# EAGLE design W706C (EAGLE 6.6.0)
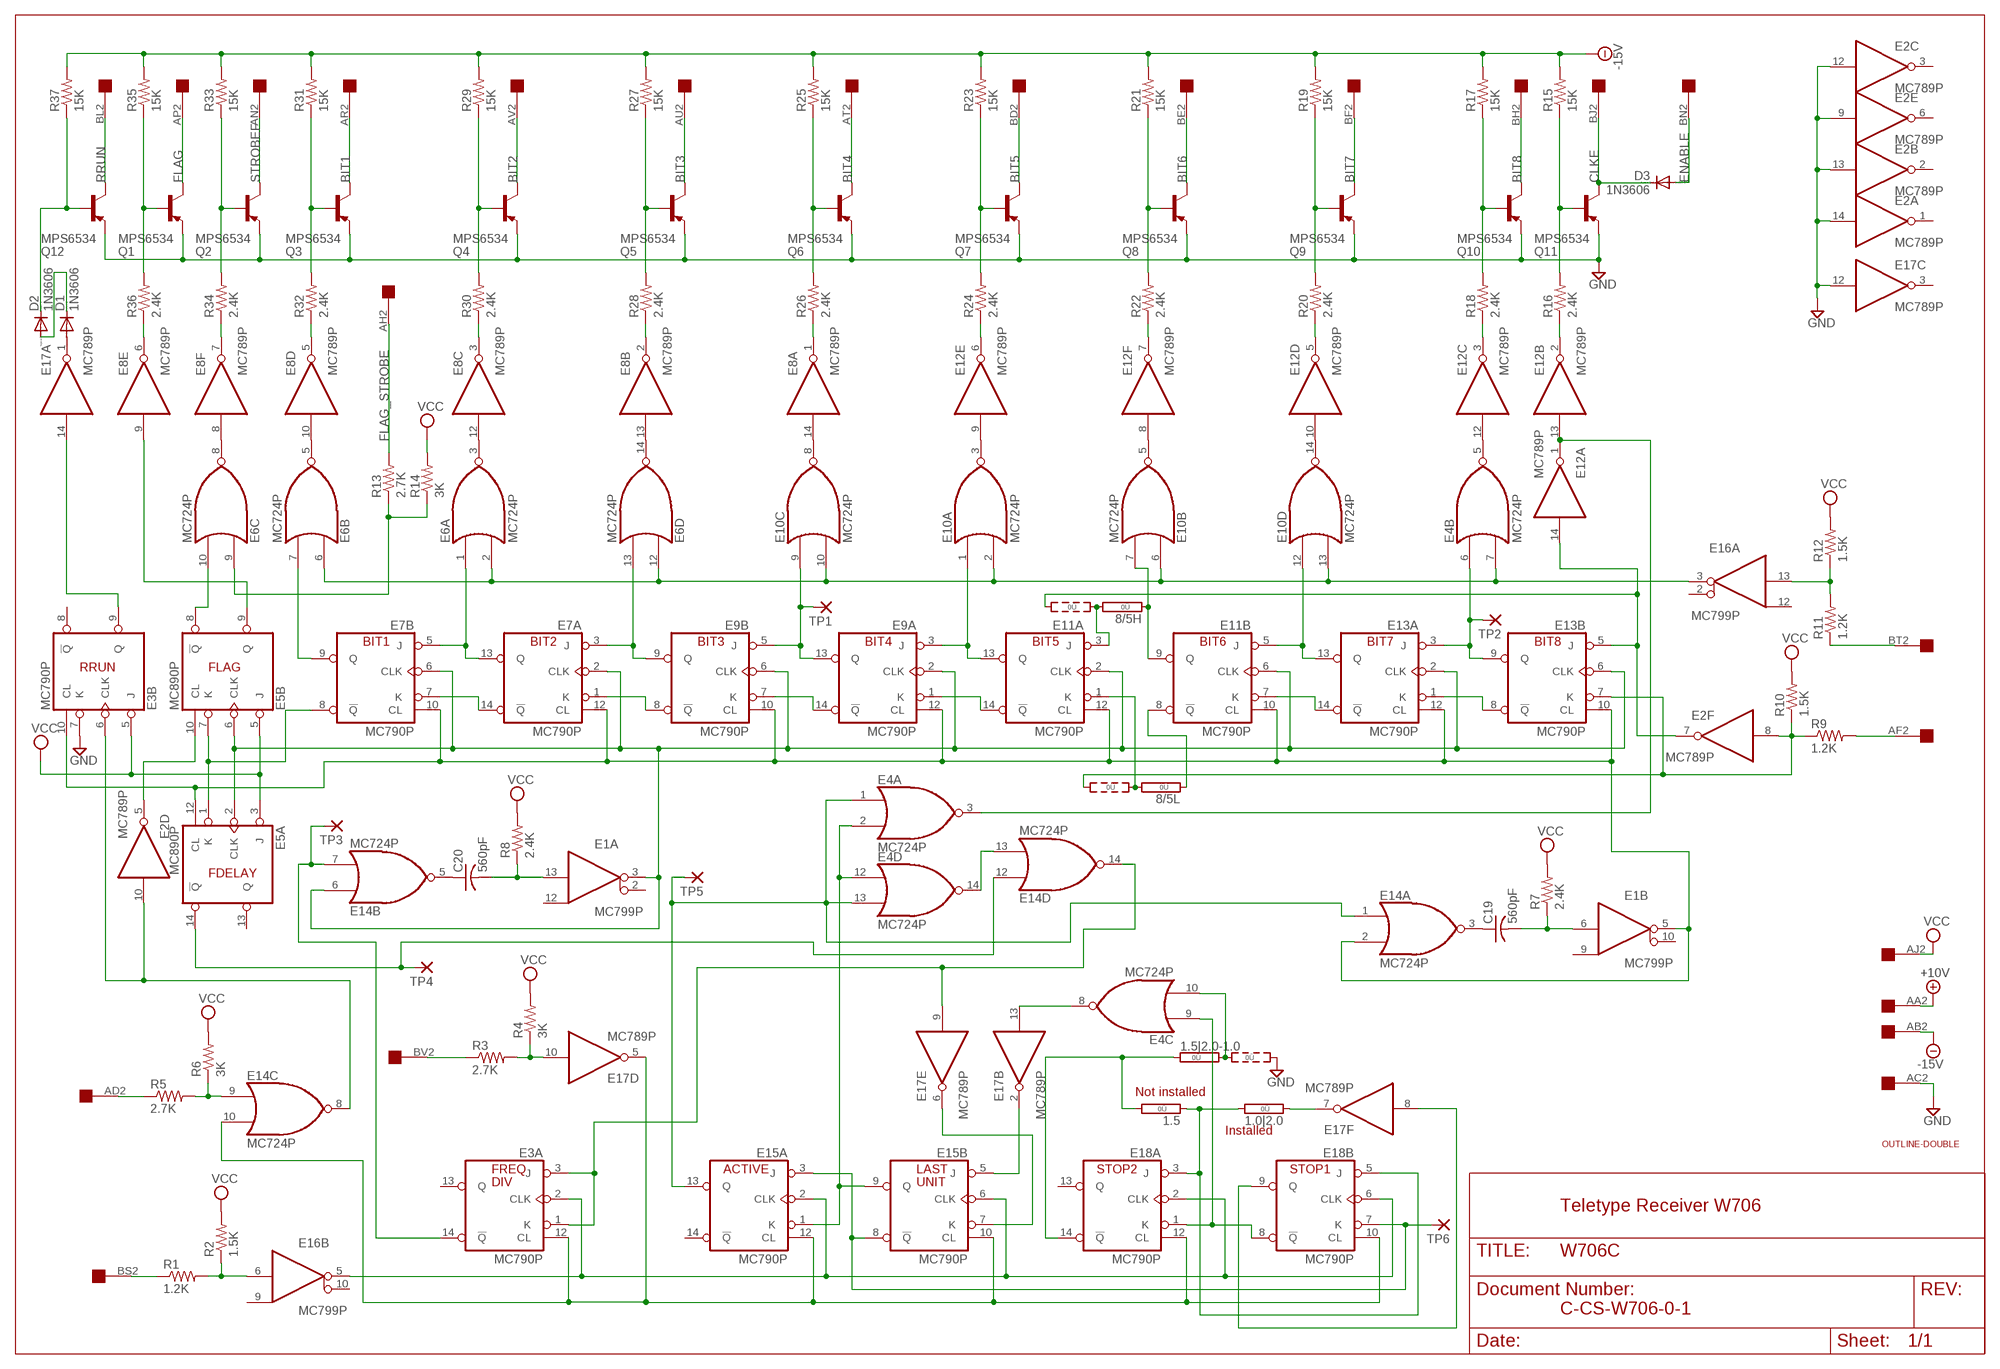
[diagram p0: schematic, sheet 1]

## Parts
1.0|2.0  0R  [0R/10]
1.5  0R  [0R/10]
1.5|2.0-1.0  0R2  [0R2/10]
8/5H  0R2  [0R2/10]
8/5L  0R2  [0R2/10]
C19  560pF  C-US050-025X075  [C050-025X075]
C20  560pF  C-US050-025X075  [C050-025X075]
D1  1N3606  1N4148DO35-10  [DO35-10]
D2  1N3606  1N4148DO35-10  [DO35-10]
D3  1N3606  1N4148DO35-10  [DO35-10]
E1  MC799P  MC899P  [DIL14]
E2  MC789P  MC889P  [DIL14]
E3  MC790P  MC890P  [DIL14]
E4  MC724P  MC824P  [DIL14]
E5  MC890P  [DIL14]
E6  MC724P  MC824P  [DIL14]
E7  MC790P  MC890P  [DIL14]
E8  MC789P  MC889P  [DIL14]
E9  MC790P  MC890P  [DIL14]
E10  MC724P  MC824P  [DIL14]
E11  MC790P  MC890P  [DIL14]
E12  MC789P  MC889P  [DIL14]
E13  MC790P  MC890P  [DIL14]
E14  MC724P  MC824P  [DIL14]
E15  MC790P  MC890P  [DIL14]
E16  MC799P  MC899P  [DIL14]
E17  MC789P  MC889P  [DIL14]
E18  MC790P  MC890P  [DIL14]
Q1  MPS6534  2N2904  [TO39]
Q2  MPS6534  2N2904  [TO39]
Q3  MPS6534  2N2904  [TO39]
Q4  MPS6534  2N2904  [TO39]
Q5  MPS6534  2N2904  [TO39]
Q6  MPS6534  2N2904  [TO39]
Q7  MPS6534  2N2904  [TO39]
Q8  MPS6534  2N2904  [TO39]
Q9  MPS6534  2N2904  [TO39]
Q10  MPS6534  2N2904  [TO39]
Q11  MPS6534  2N2904  [TO39]
Q12  MPS6534  2N2904  [TO39]
R1  1.2K  R-US_0207/10  [0207/10]
R2  1.5K  R-US_0207/10  [0207/10]
R3  2.7K  R-US_0207/10  [0207/10]
R4  3K  R-US_0207/10  [0207/10]
R5  2.7K  R-US_0207/10  [0207/10]
R6  3K  R-US_0207/10  [0207/10]
R7  2.4K  R-US_0207/10  [0207/10]
R8  2.4K  R-US_0207/10  [0207/10]
R9  1.2K  R-US_0207/10  [0207/10]
R10  1.5K  R-US_0207/10  [0207/10]
R11  1.2K  R-US_0207/10  [0207/10]
R12  1.5K  R-US_0207/10  [0207/10]
R13  2.7K  R-US_0207/10  [0207/10]
R14  3K  R-US_0207/10  [0207/10]
R15  15K  R-US_0207/10  [0207/10]
R16  2.4K  R-US_0207/10  [0207/10]
R17  15K  R-US_0207/10  [0207/10]
R18  2.4K  R-US_0207/10  [0207/10]
R19  15K  R-US_0207/10  [0207/10]
R20  2.4K  R-US_0207/10  [0207/10]
R21  15K  R-US_0207/10  [0207/10]
R22  2.4K  R-US_0207/10  [0207/10]
R23  15K  R-US_0207/10  [0207/10]
R24  2.4K  R-US_0207/10  [0207/10]
R25  15K  R-US_0207/10  [0207/10]
R26  2.4K  R-US_0207/10  [0207/10]
R27  15K  R-US_0207/10  [0207/10]
R28  2.4K  R-US_0207/10  [0207/10]
R29  15K  R-US_0207/10  [0207/10]
R30  2.4K  R-US_0207/10  [0207/10]
R31  15K  R-US_0207/10  [0207/10]
R32  2.4K  R-US_0207/10  [0207/10]
R33  15K  R-US_0207/10  [0207/10]
R34  2.4K  R-US_0207/10  [0207/10]
R35  15K  R-US_0207/10  [0207/10]
R36  2.4K  R-US_0207/10  [0207/10]
R37  15K  R-US_0207/10  [0207/10]
TP1  3,17/1,3  [3,17/1,3]
TP2  3,17/1,3  [3,17/1,3]
TP3  3,17/1,3  [3,17/1,3]
TP4  3,17/1,3  [3,17/1,3]
TP5  3,17/1,3  [3,17/1,3]
TP6  3,17/1,3  [3,17/1,3]
U$1  OUTLINE-DOUBLE  [DOUBLE]
U$2  DOUBLE  [EDGE-CON4]

## Nets
+10V [Supply]: U$2.AA2
-15V [Supply]: R15.2 R17.2 R19.2 R21.2 R23.2 R25.2 R27.2 R29.2 R31.2 R33.2 R35.2 R37.2 U$2.AB2
BIT1: Q3.3(C) U$2.AR2
BIT2: Q4.3(C) U$2.AV2
BIT3: Q5.3(C) U$2.AU2
BIT4: Q6.3(C) U$2.AT2
BIT5: Q7.3(C) U$2.BD2
BIT6: Q8.3(C) U$2.BE2
BIT7: Q9.3(C) U$2.BF2
BIT8: Q10.3(C) U$2.BH2
CLKE: D3.C Q11.3(C) U$2.BJ2
ENABLE: D3.A U$2.BN2
FLAG: Q1.3(C) U$2.AP2
FLAG_STROBE: R13.2 U$2.AH2
GND [Supply]: 1.5|2.0-1.0.3 E2.9(E:I) E2.12(C:I) E2.13(B:I) E2.14(A:I) E3.7(B:K) E17.12(C:I) Q1.1(E) Q2.1(E) Q3.1(E) Q4.1(E) Q5.1(E) Q6.1(E) Q7.1(E) Q8.1(E) Q9.1(E) Q10.1(E) Q11.1(E) Q12.1(E) U$2.AC2
N$1: E6.3(A:O) E8.12(C:I)
N$2: E6.5(B:O) E8.10(D:I)
N$3: E6.8(C:O) E8.8(F:I)
N$4: E6.14(D:O) E8.13(B:I)
N$5: E10.3(A:O) E12.9(E:I)
N$6: E10.5(B:O) E12.8(F:I)
N$7: E10.14(D:O) E12.10(D:I)
N$8: E8.14(A:I) E10.8(C:O)
N$9: E4.5(B:O) E12.12(C:I)
N$10: D1.A E17.1(A:O)
N$11: D1.C D2.A
N$12: D2.C Q12.2(B) R37.1
N$13: E12.2(B:O) R16.1
N$14: E12.3(C:O) R18.1
N$15: E12.5(D:O) R20.1
N$16: E12.7(F:O) R22.1
N$17: E12.6(E:O) R24.1
N$18: E8.1(A:O) R26.1
N$19: E8.2(B:O) R28.1
N$20: E8.3(C:O) R30.1
N$21: E8.5(D:O) R32.1
N$22: E8.6(E:O) R36.1
N$23: Q1.2(B) R35.1 R36.2
N$24: E8.7(F:O) R34.1
N$25: Q2.2(B) R33.1 R34.2
N$26: Q3.2(B) R31.1 R32.2
N$27: Q4.2(B) R29.1 R30.2
N$28: Q5.2(B) R27.1 R28.2
N$29: Q6.2(B) R25.1 R26.2
N$30: Q7.2(B) R23.1 R24.2
N$31: Q8.2(B) R21.1 R22.2
N$32: Q9.2(B) R19.1 R20.2
N$33: Q10.2(B) R17.1 R18.2
N$34: Q11.2(B) R15.1 R16.2
N$35: E3.9(B:Q) E17.14(A:I)
N$36: E5.9(B:Q) E8.9(E:I)
N$37: E5.8(B:!Q) E6.10(C:I1)
N$38: E7.7(B:K) E7.14(A:!Q)
N$39: E6.1(A:I0) E7.5(B:J) E7.13(A:Q)
N$40: E1.3(A:O) E5.2(A:CLK) E5.6(B:CLK) E7.2(A:CLK) E7.6(B:CLK) E9.2(A:CLK) E9.6(B:CLK) E11.2(A:CLK) E11.6(B:CLK) E13.2(A:CLK) E13.6(B:CLK) E14.6(B:I0)
N$41: E1.5(B:O) E3.10(B:CL) E5.12(A:CL) E7.10(B:CL) E7.12(A:CL) E9.10(B:CL) E9.12(A:CL) E11.10(B:CL) E11.12(A:CL) E13.10(B:CL) E13.12(A:CL) E14.2(A:I1)
N$42: E6.13(D:I1) E7.3(A:J) E9.9(B:Q)
N$43: E7.1(A:K) E9.8(B:!Q)
N$44: E9.5(B:J) E9.13(A:Q) E10.9(C:I0) TP1.1(P)
N$45: E9.7(B:K) E9.14(A:!Q)
N$46: E10.12(D:I0) E11.5(B:J) E13.13(A:Q)
N$47: E11.7(B:K) E13.14(A:!Q)
N$48: E9.3(A:J) E10.1(A:I0) E11.13(A:Q)
N$49: E9.1(A:K) E11.14(A:!Q)
N$50: 8/5H.1 E10.7(B:I1) E11.9(B:Q)
N$51: 8/5L.1 E11.8(B:!Q)
N$52: E4.6(B:I0) E13.3(A:J) E13.9(B:Q) TP2.1(P)
N$53: E13.1(A:K) E13.8(B:!Q)
N$54: R1.1 U$2.BS2
N$55: E4.7(B:I1) E6.2(A:I1) E6.6(B:I0) E6.12(D:I0) E10.2(A:I1) E10.6(B:I0) E10.10(C:I1) E10.13(D:I1) E16.3(A:O)
N$56: E6.7(B:I1) E7.9(B:Q)
N$57: E16.6(B:I) R1.2 R2.1
N$58: R11.1 U$2.BT2
N$59: E16.13(A:I) R11.2 R12.1
N$60: E4.2(A:I1) E4.12(D:I0) E15.1(A:K) E15.9(B:Q)
N$61: E2.10(D:I) E3.6(B:CLK) E14.8(C:O)
N$62: E4.9(C:I0) E18.1(A:K) E18.8(B:!Q)
N$63: E15.3(A:J) E15.8(B:!Q) E18.7(B:K) TP6.1(P)
N$64: E4.3(A:O) E12.1(A:O) E12.13(B:I)
N$65: 8/5L.3 E2.8(F:I) E13.7(B:K) R9.1 R10.1
N$66: 8/5H.2 E11.3(A:J)
N$67: 8/5L.2 E11.1(A:K)
N$68: E14.9(C:I0) R5.2 R6.1
N$69: R9.2 U$2.AF2
N$70: 8/5H.3 E2.7(F:O) E12.14(A:I) E13.5(B:J)
N$71: E6.9(C:I0) R13.1 R14.1
N$72: R5.1 U$2.AD2
N$73: E4.1(A:I0) E4.13(D:I1) E14.1(A:I0) E15.13(A:Q) TP5.1(P)
N$74: E2.5(D:O) E5.10(B:CL)
N$75: E3.2(A:CLK) E15.2(A:CLK) E15.6(B:CLK) E16.5(B:O) E18.2(A:CLK) E18.6(B:CLK)
N$76: 1.5|2.0-1.0.2 E4.10(C:I1)
N$77: E17.10(D:I) R3.2 R4.1
N$78: R3.1 U$2.BV2
N$79: E4.8(C:O) E17.13(B:I)
N$80: E3.12(A:CL) E14.10(C:I1) E15.10(B:CL) E15.12(A:CL) E17.5(D:O) E18.10(B:CL) E18.12(A:CL)
N$81: 1.0|2.0.2 1.5.1 E18.3(A:J) E18.5(B:J)
N$82: 1.5.2 1.5|2.0-1.0.1 E18.14(A:!Q)
N$83: E15.5(B:J) E17.2(B:O)
N$84: E4.14(D:O) E14.13(D:I1)
N$85: C20.2 E1.13(A:I) R8.1
N$86: C19.2 E1.6(B:I) R7.1
N$87: C20.1 E14.5(B:O)
N$88: C19.1 E14.3(A:O)
N$89: 1.0|2.0.1 E17.7(F:O)
N$90: E17.8(F:I) E18.9(B:Q)
N$91: E3.14(A:!Q) E14.7(B:I1) TP3.1(P)
N$92: E5.1(A:K) E5.7(B:K) E7.8(B:!Q)
N$93: E15.7(B:K) E17.6(E:O)
N$94: E5.14(A:!Q) E14.12(D:I0) TP4.1(P)
N$95: E3.1(A:K) E3.3(A:J) E14.14(D:O) E17.9(E:I)
RRUN: Q12.3(C) U$2.BL2
STROBEF: Q2.3(C) U$2.AN2
VCC [Supply]: E3.5(B:J) E5.3(A:J) E5.5(B:J) R2.2 R4.2 R6.2 R7.2 R8.2 R10.2 R12.2 R14.2 U$2.AJ2
Unconnected: E1.2(A:E) E1.9(B:R) E1.10(B:E) E1.12(A:R) E2.1(A:O) E2.2(B:O) E2.3(C:O) E2.6(E:O) E3.8(B:!Q) E3.13(A:Q) E5.13(A:Q) E15.14(A:!Q) E16.2(A:E) E16.9(B:R) E16.10(B:E) E16.12(A:R) E17.3(C:O) E18.13(A:Q) U$2.AA1 U$2.AB1 U$2.AC1 U$2.AD1 U$2.AE1 U$2.AE2 U$2.AF1 U$2.AH1 U$2.AJ1 U$2.AK1 U$2.AK2 U$2.AL1 U$2.AL2 U$2.AM1 U$2.AM2 U$2.AN1 U$2.AP1 U$2.AR1 U$2.AS1 U$2.AS2 U$2.AT1 U$2.AU1 U$2.AV1 U$2.BA1 U$2.BA2 U$2.BB1 U$2.BB2 U$2.BC1 U$2.BC2 U$2.BD1 U$2.BE1 U$2.BF1 U$2.BH1 U$2.BJ1 U$2.BK1 U$2.BK2 U$2.BL1 U$2.BM1 U$2.BM2 U$2.BN1 U$2.BP1 U$2.BP2 U$2.BR1 U$2.BR2 U$2.BS1 U$2.BT1 U$2.BU1 U$2.BU2 U$2.BV1

## Notes on the sheet
- BIT1 | BIT2 | BIT3 | BIT4 | BIT5 | BIT6 | BIT7 | BIT8
- RRUN | FLAG
- FDELAY
- Not installed
- Installed
- FREQ | ACTIVE | LAST | STOP2 | STOP1
- DIV | UNIT
- Teletype Receiver W706
- C-CS-W706-0-1

## Power pins joined to a net without a drawn wire
GND: E1.4(PWR:GND) E2.4(PWR:GND) E3.4(PWR:GND) E4.4(PWR:GND) E5.4(PWR:GND) E6.4(PWR:GND) E7.4(PWR:GND) E8.4(PWR:GND) E9.4(PWR:GND) E10.4(PWR:GND) E11.4(PWR:GND) E12.4(PWR:GND) E13.4(PWR:GND) E14.4(PWR:GND) E15.4(PWR:GND) E16.4(PWR:GND) E17.4(PWR:GND) E18.4(PWR:GND)
VCC: E1.11(PWR:VCC) E2.11(PWR:VCC) E3.11(PWR:VCC) E4.11(PWR:VCC) E5.11(PWR:VCC) E6.11(PWR:VCC) E7.11(PWR:VCC) E8.11(PWR:VCC) E9.11(PWR:VCC) E10.11(PWR:VCC) E11.11(PWR:VCC) E12.11(PWR:VCC) E13.11(PWR:VCC) E14.11(PWR:VCC) E15.11(PWR:VCC) E16.11(PWR:VCC) E17.11(PWR:VCC) E18.11(PWR:VCC)

## Library data of the parts
1.0|2.0 1.5 = jumper:0R: Bridge 0R 10mm
1.5|2.0-1.0 8/5H 8/5L = jumper:0R2: Bridge switch 0R 2 x 10mm
C19 C20 = rcl:C-US: CAPACITOR, American symbol
D1-D3 = diode:1N4148: DIODE high speed (Philips)
E1 E16 = dec-con:MC899: RTL Dual Buffer
E2 E8 E12 E17 = dec-con:MC889: RTL Hex Inverter
E3 E5 E7 E9 E11 E13 E15 E18 = dec-con:MC890: RTL Dual JK Flip-Flop
E4 E6 E10 E14 = dec-con:MC824: RTL Quad NOR Gate
Q1-Q12 = transistor-pnp:2N2904*: PNP Transistror
R1-R37 = rcl:R-US_: RESISTOR, American symbol
TP1-TP6 = wirepad:3,17/1,3: THROUGH-HOLE PAD
U$1 = dec-con:OUTLINE-*: Board outlines for DEC boards.
U$2 = dec-con:DOUBLE: Double-Height DEC board

## Net classes
1 Supply: width 0.813 mm

## Board
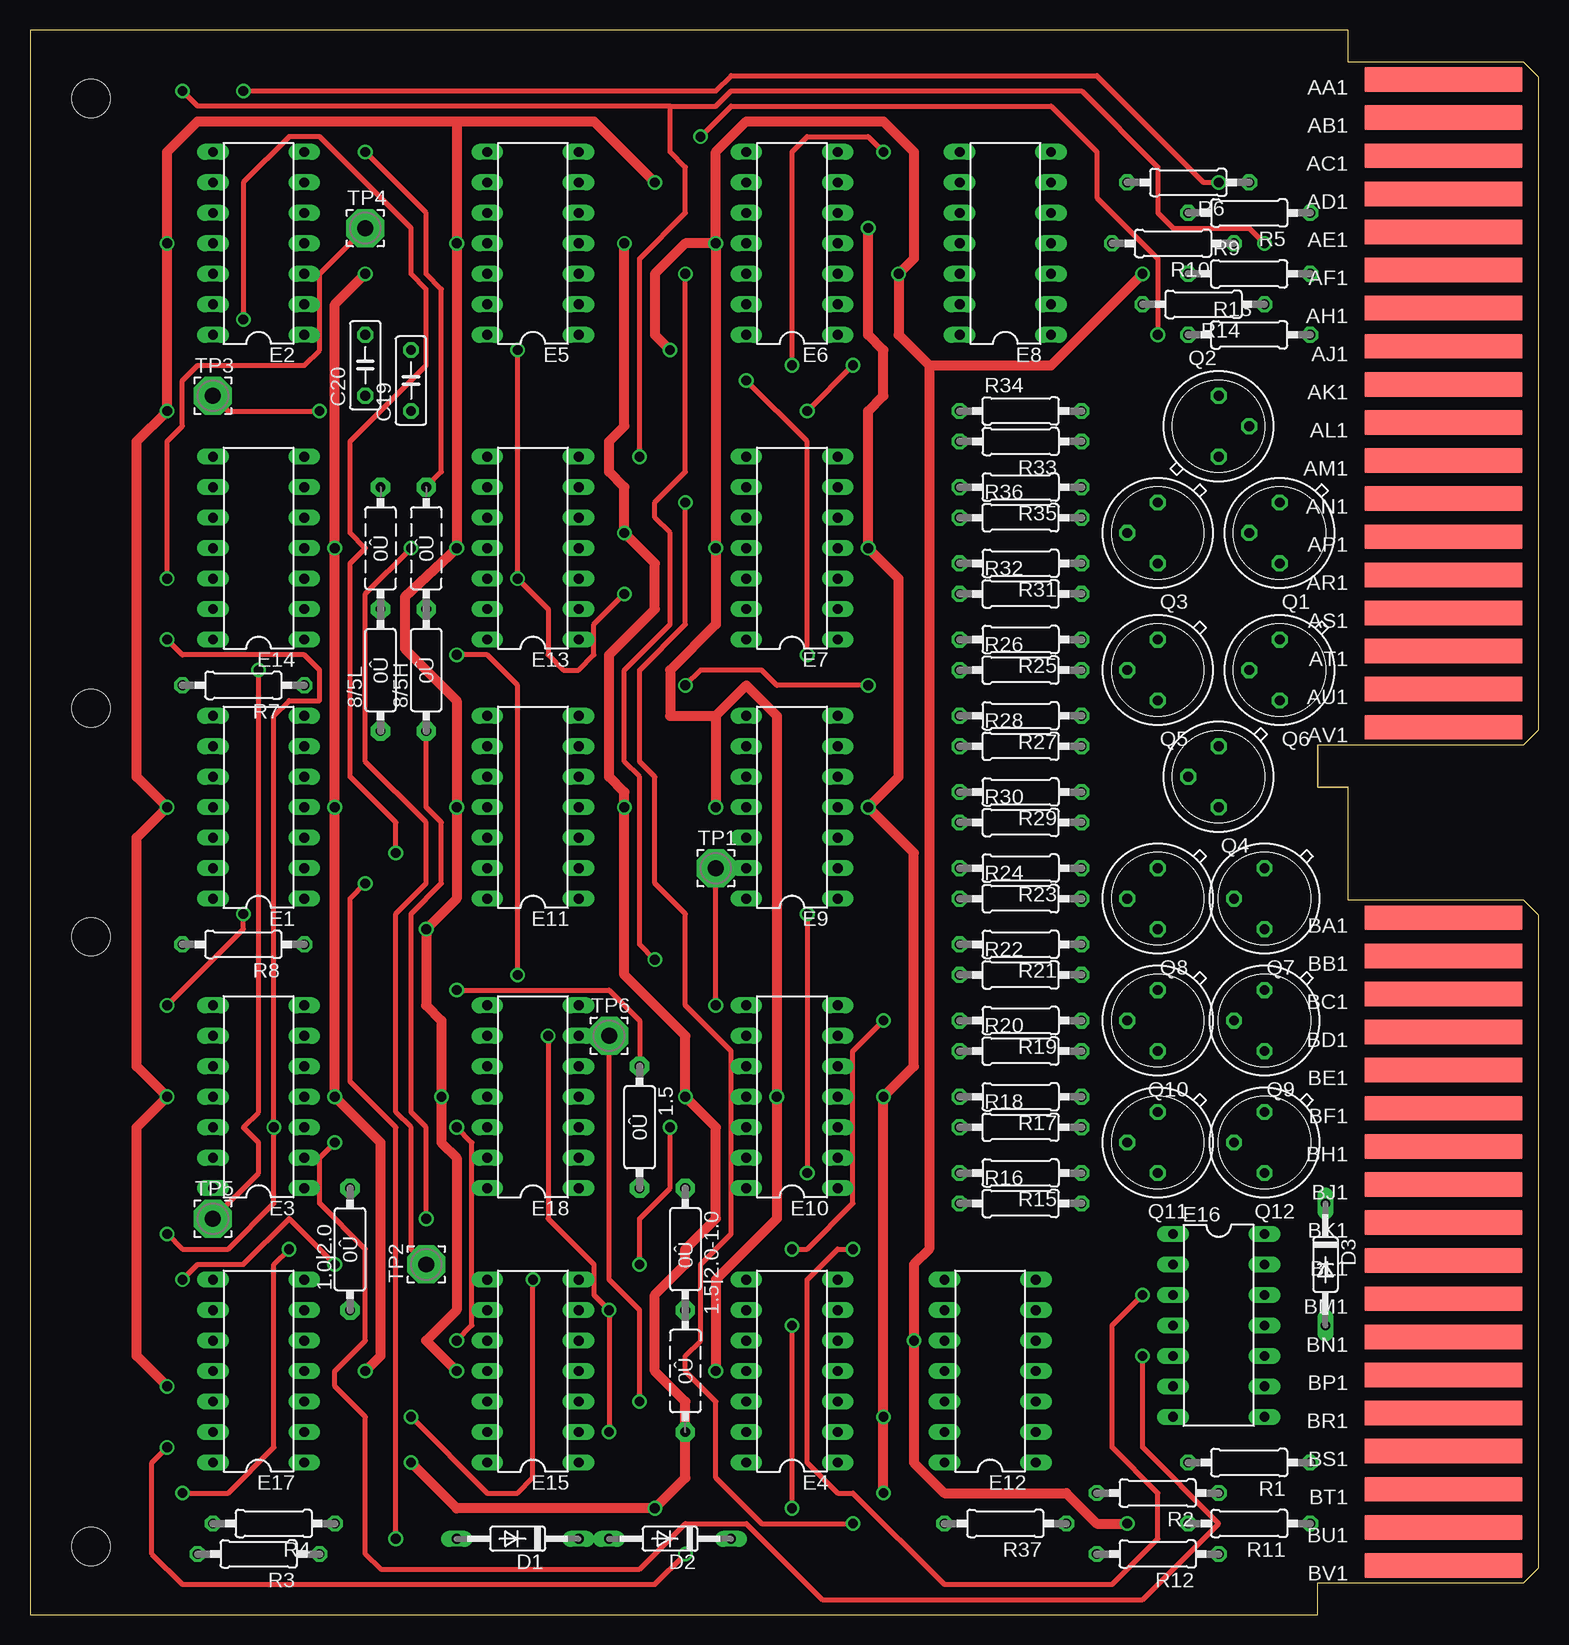
[diagram p1: board, top side]
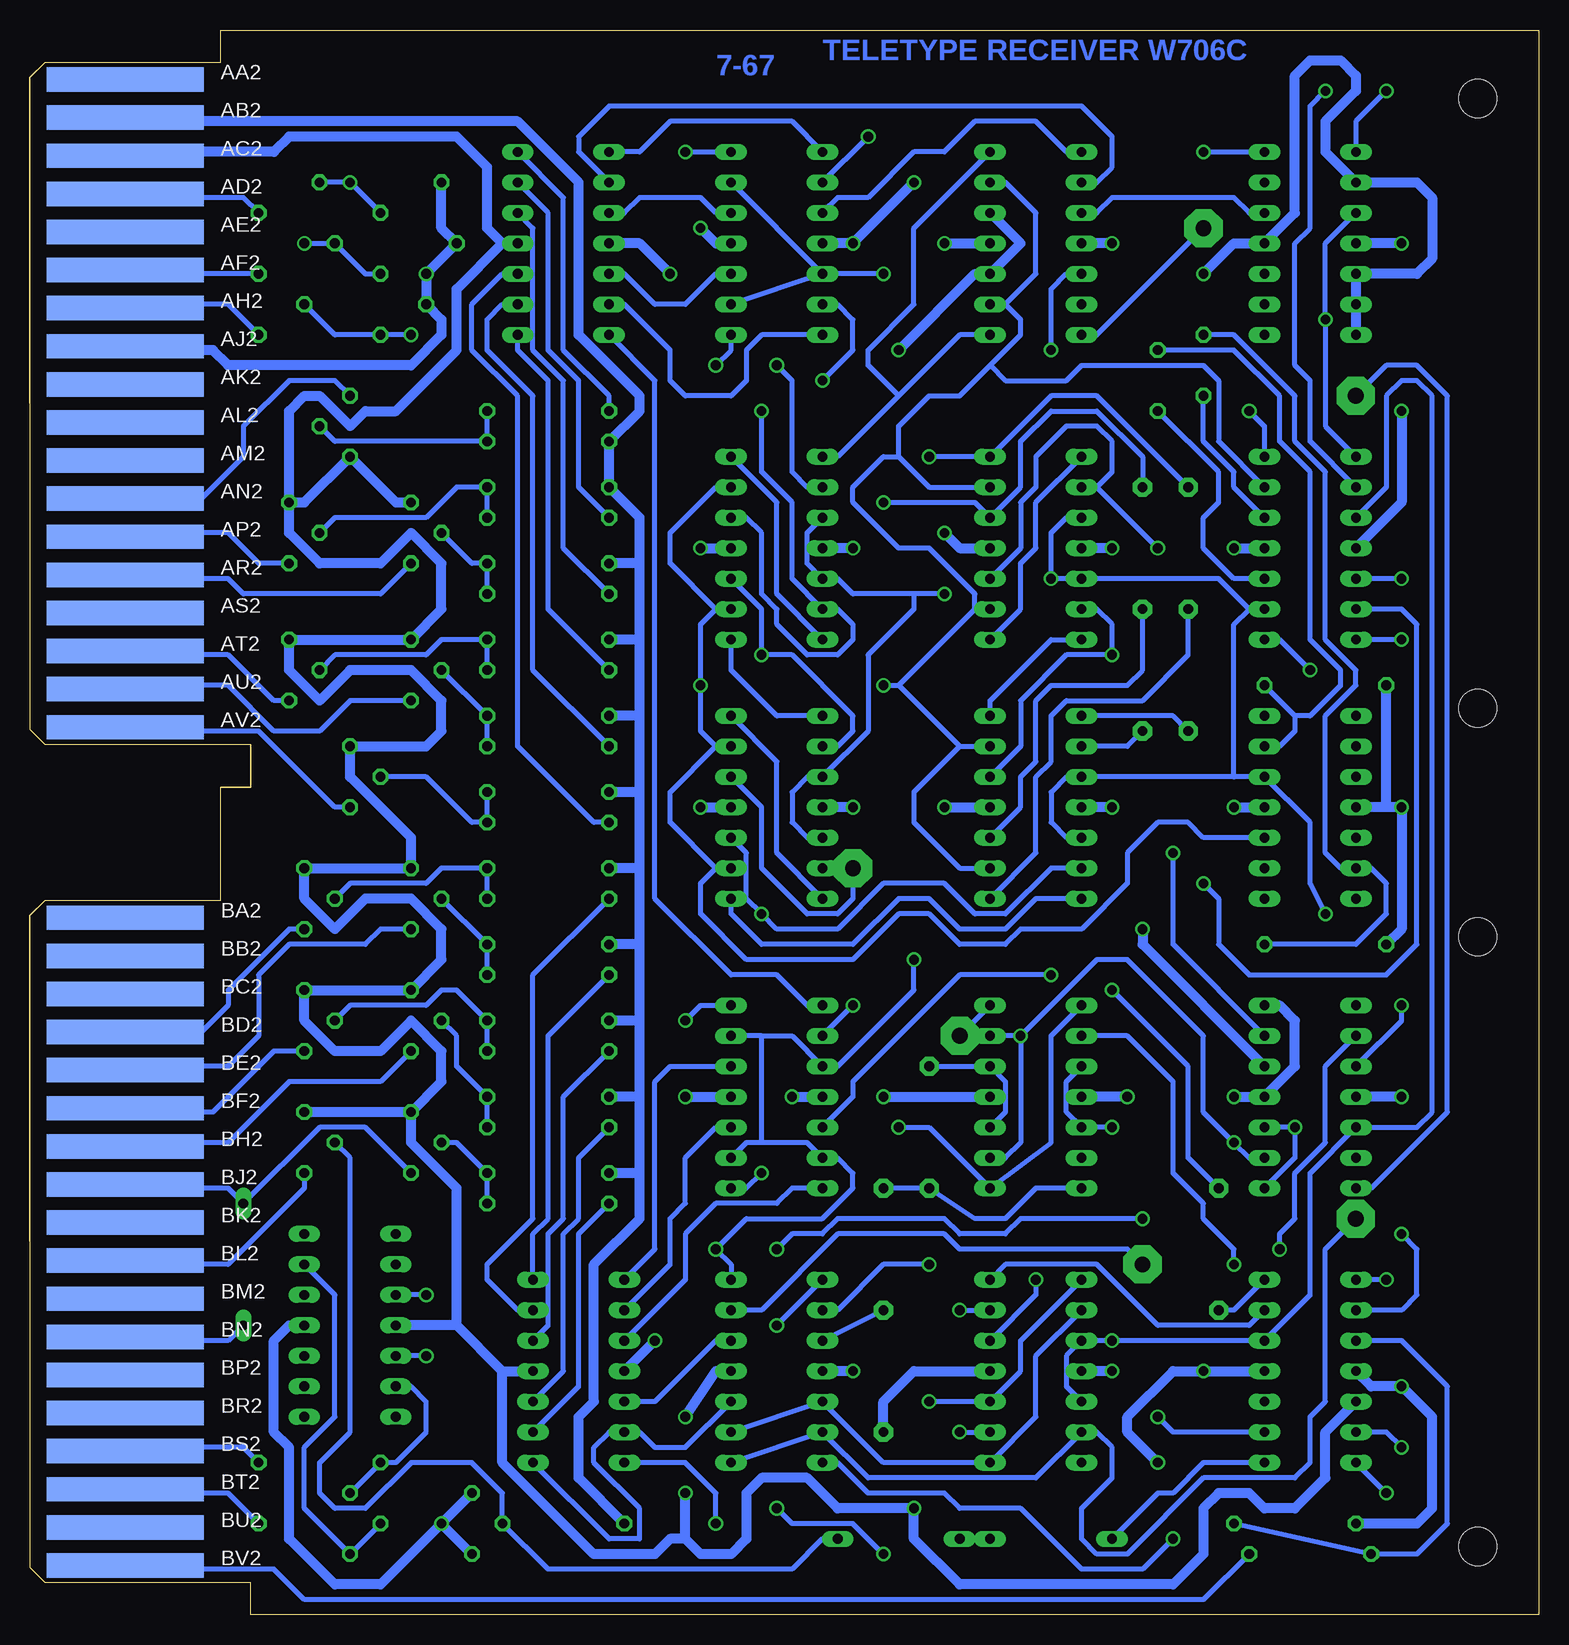
[diagram p2: board, bottom side, seen from below]

Size 125.73 x 132.08 mm. Coordinates in mm from the lower left corner, seen from the top.
Copper layers (1+16): Top 0.035mm / dielectric 1.5mm / Bottom 0.035mm
Design rules "16mils": minimum track width 16mil, minimum drill 32mil, track to track 15mil, track to pad 10mil, pad to pad 10mil, via to via 10mil, smd to smd 10mil, copper to edge 13mil, drill to drill 10mil, minimum pad ring 10mil, minimum via ring 8mil, stop-mask expansion 0mil, vias tented up to drill 0mil, thermal gap 10mil

### Footprints (pad centres in the part's own frame; a part is rotated, then mirrored left to right if it is on the bottom)
0R/10 = drill 0.813 pad 1.6 octagon: 1 -5.08,0; 2 5.08,0
0R2/10 = drill 0.813 pad 1.6 octagon: 1 -5.08,0; 2 5.08,0; 3 15.24,0
C050-025X075 = drill 0.813 octagon: 1 -2.54,0; 2 2.54,0
DO35-10 = drill 0.813 long: A 5.08,0; C -5.08,0
DIL14 = drill 0.813 long: 1 -7.62,-3.81; 2 -5.08,-3.81; 3 -2.54,-3.81; 4 0,-3.81; 5 2.54,-3.81; 6 5.08,-3.81; 7 7.62,-3.81; 8 7.62,3.81; 9 5.08,3.81; 10 2.54,3.81; 11 0,3.81; 12 -2.54,3.81; 13 -5.08,3.81; 14 -7.62,3.81
TO39 = drill 0.813 octagon: 1 0,-2.54; 2 2.54,0; 3 0,2.54
0207/10 = drill 0.813 octagon: 1 -5.08,0; 2 5.08,0
3,17/1,3 = drill 1.321 pad 3.175 octagon: 1 0,0
DOUBLE = hole 3.175: 120.65,56.515; 120.65,5.715; 120.65,75.565; 120.65,126.365
EDGE-CON4 = smd 13.106 x 2.032: AA1 7.938,4.128; AB1 7.938,7.303; AC1 7.938,10.477; AD1 7.938,13.652; AE1 7.938,16.828; AF1 7.938,20.003; AH1 7.938,23.177; AJ1 7.938,26.352; AK1 7.938,29.527; AL1 7.938,32.703; AM1 7.938,35.877; AN1 7.938,39.053; AP1 7.938,42.227; AR1 7.938,45.403; AS1 7.938,48.578; AT1 7.938,51.752; AU1 7.938,54.928; AV1 7.938,58.102; BA1 7.938,73.978; BB1 7.938,77.153; BC1 7.938,80.328; BD1 7.938,83.502; BE1 7.938,86.677; BF1 7.938,89.853; BH1 7.938,93.028; BJ1 7.938,96.203; BK1 7.938,99.377; BL1 7.938,102.552; BM1 7.938,105.728; BN1 7.938,108.903; BP1 7.938,112.078; BR1 7.938,115.252; BS1 7.938,118.427; BT1 7.938,121.603; BU1 7.938,124.778; BV1 7.938,127.953 | smd 13.106 x 2.032 bottom: AA2 7.938,4.128; AB2 7.938,7.303; AC2 7.938,10.477; AD2 7.938,13.652; AE2 7.938,16.828; AF2 7.938,20.003; AH2 7.938,23.177; AJ2 7.938,26.352; AK2 7.938,29.527; AL2 7.938,32.703; AM2 7.938,35.877; AN2 7.938,39.053; AP2 7.938,42.227; AR2 7.938,45.403; AS2 7.938,48.578; AT2 7.938,51.752; AU2 7.938,54.928; AV2 7.938,58.102; BA2 7.938,73.978; BB2 7.938,77.153; BC2 7.938,80.328; BD2 7.938,83.502; BE2 7.938,86.677; BF2 7.938,89.853; BH2 7.938,93.028; BJ2 7.938,96.203; BK2 7.938,99.377; BL2 7.938,102.552; BM2 7.938,105.728; BN2 7.938,108.903; BP2 7.938,112.078; BR2 7.938,115.252; BS2 7.938,118.427; BT2 7.938,121.603; BU2 7.938,124.778; BV2 7.938,127.953

### Placement (x,y rotation side)
1.0|2.0  26.67,30.48 90 top
1.5  50.8,40.64 270 top
1.5|2.0-1.0  54.61,30.48 270 top
8/5H  33.02,78.74 90 top
8/5L  29.21,78.74 90 top
C19  31.75,102.87 90 top
C20  27.94,104.14 90 top
D1  40.64,6.35 180 top
D2  53.34,6.35 180 top
D3  107.95,29.21 270 top
E1  19.05,67.31 90 top
E2  19.05,114.3 90 top
E3  19.05,43.18 90 top
E4  63.5,20.32 90 top
E5  41.91,114.3 90 top
E6  63.5,114.3 90 top
E7  63.5,88.9 90 top
E8  81.28,114.3 90 top
E9  63.5,67.31 90 top
E10  63.5,43.18 90 top
E11  41.91,67.31 90 top
E12  80.01,20.32 90 top
E13  41.91,88.9 90 top
E14  19.05,88.9 90 top
E15  41.91,20.32 90 top
E16  99.06,24.13 270 top
E17  19.05,20.32 90 top
E18  41.91,43.18 90 top
Q1  104.14,90.17 180 top
Q2  99.06,99.06 0 top
Q3  93.98,90.17 180 top
Q4  99.06,69.85 180 top
Q5  93.98,78.74 180 top
Q6  104.14,78.74 180 top
Q7  102.87,59.69 180 top
Q8  93.98,59.69 180 top
Q9  102.87,49.53 180 top
Q10  93.98,49.53 180 top
Q11  93.98,39.37 180 top
Q12  102.87,39.37 180 top
R1  101.6,12.7 180 top
R2  93.98,10.16 180 top
R3  19.05,5.08 180 top
R4  20.32,7.62 180 top
R5  101.6,116.84 180 top
R6  96.52,119.38 180 top
R7  17.78,77.47 180 top
R8  17.78,55.88 180 top
R9  101.6,111.76 0 top
R10  95.25,114.3 180 top
R11  101.6,7.62 180 top
R12  93.98,5.08 180 top
R13  101.6,106.68 0 top
R14  97.79,109.22 180 top
R15  82.55,36.83 180 top
R16  82.55,34.29 0 top
R17  82.55,43.18 180 top
R18  82.55,40.64 0 top
R19  82.55,49.53 180 top
R20  82.55,46.99 0 top
R21  82.55,55.88 180 top
R22  82.55,53.34 0 top
R23  82.55,62.23 180 top
R24  82.55,59.69 0 top
R25  82.55,81.28 180 top
R26  82.55,78.74 0 top
R27  82.55,74.93 180 top
R28  82.55,72.39 0 top
R29  82.55,68.58 180 top
R30  82.55,66.04 0 top
R31  82.55,87.63 180 top
R32  82.55,85.09 0 top
R33  82.55,97.79 180 top
R34  82.55,100.33 0 top
R35  82.55,93.98 180 top
R36  82.55,91.44 0 top
R37  81.28,7.62 180 top
TP1  57.15,62.23 0 top
TP2  33.02,29.21 90 top
TP3  15.24,101.6 0 top
TP4  27.94,115.57 0 top
TP5  15.24,33.02 0 top
TP6  48.26,48.26 0 top
U$1  125.73,132.08 180 top
U$2  125.73,132.08 180 top

### Tracks (layer width: path | path; a pad name or v marks a point on that pad's centre or on a via)
-15V
  Bottom 0.813: 74.93,36.83 R15.2 | 74.93,36.83 74.93,43.18 | 74.93,43.18 74.93,49.53 | 74.93,49.53 74.93,55.88 | 74.93,55.88 74.93,62.23 | 74.93,62.23 74.93,68.58 | 74.93,68.58 74.93,74.93 | 74.93,74.93 74.93,81.28 | 74.93,81.28 74.93,87.63 | 74.93,87.63 74.93,91.44 R35.2 R33.2 74.93,100.33 74.93,101.6 80.01,106.68 80.01,119.38 85.09,124.46 115.57,124.46 115.86,124.75 U$2.AB2 | 74.93,87.63 R31.2 | 74.93,81.28 R25.2 | 74.93,74.93 R27.2 | 74.93,68.58 R29.2 | 74.93,62.23 R23.2 | 74.93,55.88 R21.2 | 74.93,49.53 R19.2 | 74.93,43.18 R17.2 | 74.93,36.83 74.93,33.02 78.74,29.21 78.74,17.78 80.01,16.51 80.01,11.43 R37.2
BIT1
  Bottom 0.406: U$2.AR2 117.17,86.69 116.84,86.36 109.22,86.36 107.95,85.09 96.52,85.09 Q3.3
BIT2
  Bottom 0.406: U$2.AV2 117.23,74.05 116.84,73.66 106.68,73.66 100.33,67.31 Q4.3
BIT3
  Bottom 0.406: U$2.AU2 117.2,77.11 116.84,77.47 109.22,77.47 105.41,73.66 101.6,73.66 99.06,76.2 Q5.3
BIT4
  Bottom 0.406: U$2.AT2 117.17,80.34 116.84,80.01 109.22,80.01 105.41,76.2 Q6.3
BIT5
  Bottom 0.406: U$2.BD2 117.14,48.56 116.84,48.26 111.76,48.26 109.22,50.8 109.22,52.07 104.14,57.15 Q7.3
BIT6
  Bottom 0.406: U$2.BE2 117.17,45.39 116.84,45.72 109.22,45.72 106.68,48.26 106.68,53.34 104.14,55.88 97.79,55.88 96.52,57.15 Q8.3
BIT7
  Bottom 0.406: U$2.BF2 117.12,42.19 116.84,41.91 110.49,41.91 105.41,46.99 Q9.3
BIT8
  Bottom 0.406: U$2.BH2 117.17,39.04 116.84,39.37 109.22,39.37 104.14,44.45 96.52,44.45 Q10.3
CLKE
  Bottom 0.406: U$2.BJ2 117.17,35.89 116.84,35.56 109.22,35.56 D3.C 101.6,40.64 97.79,40.64 Q11.3
ENABLE
  Bottom 0.406: U$2.BN2 117.17,23.19 116.84,22.86 109.22,22.86 D3.A
FLAG
  Bottom 0.406: U$2.AP2 117.17,89.84 116.84,90.17 109.22,90.17 106.68,87.63 Q1.3
FLAG_STROBE
  Bottom 0.406: U$2.AH2 117.17,108.89 116.84,109.22 109.22,109.22 R13.2
GND  (via drill 0.81)
  Top 0.813: v69.85,115.57 69.85,106.68 71.12,105.41 71.12,101.6 69.85,100.33 v69.85,88.9 72.39,86.36 72.39,69.85 v69.85,67.31 73.66,63.5 73.66,45.72 v71.12,43.18 v71.12,16.51 v71.12,10.16 | v49.53,114.3 49.53,99.06 48.26,97.79 48.26,95.25 49.53,93.98 v49.53,90.17 52.07,87.63 52.07,83.82 48.26,80.01 48.26,69.85 49.53,68.58 v49.53,67.31 49.53,53.34 54.61,48.26 v54.61,43.18 57.15,40.64 57.15,33.02 54.61,30.48 54.61,29.21 52.07,26.67 52.07,20.32 54.61,17.78 1.5|2.0-1.0.3 54.61,11.43 v52.07,8.89 35.56,8.89 v31.75,12.7 | v27.94,111.76 25.4,109.22 v25.4,88.9 v25.4,67.31 v25.4,43.18 29.21,39.37 29.21,21.59 v27.94,20.32
  Bottom 0.813: Q11.1 Q12.1 | Q3.1 95.25,92.71 Q2.1 102.87,92.71 Q1.1 | 86.36,20.32 E12.4 | 86.36,20.32 90.17,24.13 | 90.17,24.13 E16.4 | Q11.1 93.98,39.37 90.17,35.56 90.17,24.13 | Q11.1 91.44,44.45 91.44,46.99 93.98,49.53 96.52,46.99 100.33,46.99 102.87,49.53 Q9.1 Q10.1 91.44,54.61 91.44,57.15 93.98,59.69 97.79,59.69 100.33,57.15 102.87,59.69 Q7.1 Q8.1 93.98,64.77 99.06,69.85 Q4.1 92.71,72.39 91.44,73.66 91.44,76.2 93.98,78.74 99.06,78.74 101.6,76.2 104.14,78.74 Q6.1 Q5.1 91.44,83.82 91.44,87.63 93.98,90.17 96.52,87.63 101.6,87.63 104.14,90.17 Q1.1 | 86.36,114.3 E8.4 | 86.36,114.3 90.17,110.49 90.17,105.41 95.25,100.33 97.79,100.33 99.06,99.06 101.6,101.6 102.87,101.6 104.14,100.33 Q1.1 | U$2.AC2 117.17,121.59 116.84,121.92 105.41,121.92 104.14,123.19 90.17,123.19 87.63,120.65 87.63,115.57 86.36,114.3 | E2.14 E2.13 E2.12 10.16,111.76 8.89,113.03 8.89,118.11 10.16,119.38 E2.9 17.78,121.92 17.78,124.46 15.24,127 15.24,128.27 16.51,129.54 19.05,129.54 20.32,128.27 20.32,116.84 E2.4 25.4,114.3 v27.94,111.76 | E6.4 68.58,114.3 v69.85,115.57 | v69.85,88.9 E7.4 | 86.36,20.32 86.36,12.7 78.74,5.08 73.66,5.08 72.39,6.35 71.12,6.35 | 71.12,6.35 v71.12,10.16 | 71.12,6.35 69.85,5.08 67.31,5.08 66.04,6.35 66.04,10.16 64.77,11.43 60.96,11.43 58.42,8.89 v52.07,8.89 52.07,6.35 48.26,2.54 30.48,2.54 27.94,5.08 27.94,8.89 26.67,10.16 24.13,10.16 22.86,8.89 20.32,8.89 17.78,11.43 17.78,15.24 E17.12 | E4.4 68.58,20.32 v71.12,16.51 | v71.12,43.18 E10.4 | v69.85,67.31 E9.4 | E15.4 52.07,20.32 54.61,17.78 1.5|2.0-1.0.3 | v54.61,43.18 E18.4 | v49.53,67.31 E11.4 | E13.4 48.26,88.9 v49.53,90.17
  Bottom 0.813: v49.53,114.3 E5.4 | v25.4,88.9 E14.4 | v25.4,67.31 E1.4 | v25.4,43.18 E3.4 20.32,45.72 20.32,49.53 21.59,50.8 E3.7 | E17.4 v27.94,20.32 30.48,20.32 34.29,16.51 34.29,15.24 v31.75,12.7
N$1
  Bottom 0.406: E6.3 68.58,111.76 71.12,109.22 73.66,109.22 76.2,111.76 E8.12
N$2
  Bottom 0.406: E6.5 68.58,116.84 69.85,118.11 74.93,118.11 76.2,116.84 E8.10
N$3
  Bottom 0.406: E6.8 62.23,124.46 72.39,124.46 74.93,121.92 E8.8
N$4
  Bottom 0.406: E6.14 64.77,106.68 66.04,105.41 66.04,102.87 67.31,101.6 71.12,101.6 72.39,102.87 72.39,105.41 76.2,109.22 E8.13
N$5
  Bottom 0.406: E10.3 68.58,40.64 71.12,38.1 71.12,34.29 72.39,33.02 72.39,29.21 E12.9
N$6
  Bottom 0.406: E10.5 72.39,45.72 73.66,44.45 73.66,30.48 E12.8
N$7
  Bottom 0.406: E12.10 71.12,27.94 71.12,31.75 68.58,34.29 63.5,34.29 62.23,35.56 E10.14
N$8
  Bottom 0.406: E8.14 73.66,102.87 73.66,59.69 67.31,53.34 63.5,53.34 60.96,50.8 E10.8
N$9
  Bottom 0.406: E12.12 73.66,17.78 68.58,22.86 E4.5
N$10
  Bottom 0.406: E17.1 27.94,12.7 30.48,10.16 31.75,10.16 D1.A
N$11
  Bottom 0.406: D1.C D2.A
N$12
  Bottom 0.406: D2.C 59.69,6.35 62.23,3.81 82.55,3.81 R37.1 86.36,10.16 88.9,12.7 93.98,12.7 97.79,8.89 100.33,8.89 101.6,10.16 101.6,12.7 99.06,15.24 99.06,38.1 Q12.2
N$13
  Bottom 0.406: R16.1 80.01,31.75 80.01,19.05 E12.2
N$14
  Bottom 0.406: E12.3 81.28,20.32 81.28,31.75 80.01,33.02 80.01,38.1 R18.1
N$15
  Bottom 0.406: E12.5 82.55,24.13 82.55,31.75 81.28,33.02 81.28,43.18 R20.1
N$16
  Bottom 0.406: E12.7 83.82,31.75 82.55,33.02 82.55,48.26 R22.1
N$17
  Bottom 0.406: R24.1 83.82,53.34 83.82,33.02 87.63,29.21 87.63,27.94 85.09,25.4 E12.6
N$18
  Bottom 0.406: R26.1 82.55,83.82 82.55,102.87 85.09,105.41 E8.1
N$19
  Bottom 0.406: R28.1 83.82,78.74 83.82,101.6 87.63,105.41 87.63,107.95 86.36,109.22 E8.2
N$20
  Bottom 0.406: R30.1 78.74,66.04 85.09,72.39 85.09,101.6 88.9,105.41 88.9,109.22 86.36,111.76 E8.3
N$21
  Bottom 0.406: R32.1 81.28,88.9 81.28,102.87 83.82,105.41 83.82,115.57 E8.5
N$22
  Bottom 0.406: R36.1 80.01,93.98 80.01,102.87 82.55,105.41 82.55,116.84 E8.6
N$23
  Bottom 0.406: R36.2 R35.1 90.17,93.98 92.71,91.44 100.33,91.44 Q1.2
N$24
  Bottom 0.406: R34.1 77.47,101.6 81.28,105.41 81.28,118.11 E8.7
N$25
  Bottom 0.406: Q2.2 100.33,97.79 R33.1 R34.2
N$26
  Bottom 0.406: R32.2 R31.1 88.9,87.63 Q3.2
N$27
  Bottom 0.406: Q4.2 92.71,69.85 88.9,66.04 R30.2 R29.1
N$28
  Bottom 0.406: R28.2 R27.1 Q5.2
N$29
  Bottom 0.406: Q6.2 100.33,80.01 92.71,80.01 91.44,81.28 R25.1 R26.2
N$30
  Bottom 0.406: R24.2 R23.1 91.44,62.23 92.71,60.96 99.06,60.96 Q7.2
N$31
  Bottom 0.406: R22.2 R21.1 Q8.2
N$32
  Bottom 0.406: R20.2 R19.1 90.17,52.07 91.44,52.07 92.71,50.8 99.06,50.8 Q9.2
N$33
  Bottom 0.406: R18.2 R17.1 90.17,45.72 90.17,48.26 Q10.2
N$34
  Bottom 0.406: R16.2 R15.1 90.17,39.37 Q11.2
N$35  (via drill 0.81)
  Top 0.406: v12.7,10.16 16.51,10.16 20.32,13.97 20.32,29.21 v21.59,30.48
  Bottom 0.406: v12.7,10.16 E17.14 | v21.59,30.48 21.59,31.75 20.32,33.02 20.32,36.83 17.78,39.37 17.78,45.72 E3.9
N$36
  Bottom 0.406: E8.9 80.01,121.92 80.01,123.19 77.47,125.73 38.1,125.73 35.56,123.19 35.56,120.65 36.83,119.38 E5.9
N$37
  Bottom 0.406: E5.8 39.37,121.92 41.91,124.46 46.99,124.46 49.53,121.92 52.07,121.92 55.88,118.11 58.42,118.11 E6.10
N$38
  Bottom 0.406: E7.14 63.5,85.09 63.5,92.71 E7.7
N$39  (via drill 0.81)
  Top 0.406: v64.77,100.33 v68.58,104.14
  Bottom 0.406: E6.1 67.31,105.41 v68.58,104.14 | v64.77,100.33 64.77,95.25 62.23,92.71 62.23,86.36 E7.13 58.42,83.82 57.15,82.55 57.15,81.28 58.42,80.01 60.96,80.01 63.5,82.55 63.5,83.82 64.77,85.09 64.77,90.17 66.04,91.44 E7.5
N$40  (via drill 0.81)
  Top 0.406: v69.85,77.47 62.23,77.47 60.96,78.74 55.88,78.74 v54.61,77.47
  Bottom 0.406: E1.3 27.94,64.77 29.21,66.04 31.75,66.04 34.29,63.5 34.29,60.96 38.1,57.15 43.18,57.15 44.45,55.88 48.26,55.88 50.8,58.42 53.34,58.42 57.15,54.61 66.04,54.61 69.85,58.42 69.85,60.96 68.58,62.23 | 68.58,62.23 E9.2 | 68.58,72.39 E9.6 | 68.58,72.39 72.39,68.58 72.39,66.04 68.58,62.23 | 68.58,83.82 72.39,87.63 72.39,90.17 68.58,93.98 E7.6 | 68.58,72.39 69.85,73.66 v69.85,77.47 69.85,82.55 68.58,83.82 | 48.26,72.39 E11.6 | 53.34,77.47 48.26,72.39 | v54.61,77.47 53.34,77.47 | E11.2 48.26,62.23 52.07,66.04 52.07,68.58 48.26,72.39 | 46.99,83.82 E13.2 | 53.34,77.47 46.99,83.82 | E13.6 50.8,93.98 53.34,96.52 | 53.34,96.52 54.61,96.52 57.15,93.98 57.15,92.71 53.34,88.9 50.8,88.9 46.99,85.09 46.99,83.82 | 68.58,83.82 E7.2 | E5.6 44.45,119.38 41.91,116.84 41.91,111.76 44.45,109.22 | 44.45,109.22 E5.2 | 44.45,109.22 43.18,107.95 43.18,106.68 45.72,104.14 | 45.72,104.14 48.26,101.6 50.8,101.6 53.34,99.06 53.34,96.52 | E14.6 26.67,97.79 26.67,102.87 27.94,104.14 38.1,104.14 39.37,102.87 44.45,102.87 45.72,104.14
N$41  (via drill 0.81)
  Top 0.406: v49.53,85.09 46.99,82.55 46.99,80.01 45.72,78.74 44.45,78.74 43.18,80.01 43.18,83.82 v40.64,86.36 v40.64,105.41 | v11.43,50.8 17.78,57.15 v17.78,58.42
  Bottom 0.406: E11.12 39.37,64.77 40.64,66.04 40.64,68.58 39.37,69.85 E11.10 25.4,69.85 | 24.13,83.82 E14.2 | 24.13,83.82 25.4,82.55 25.4,69.85 | 24.13,83.82 26.67,86.36 E13.12 v40.64,86.36 40.64,90.17 39.37,91.44 E13.10 | 25.4,69.85 E1.5 19.05,66.04 19.05,60.96 v17.78,58.42 | v49.53,85.09 52.07,85.09 | 52.07,85.09 57.15,85.09 58.42,86.36 E7.12 60.96,87.63 60.96,90.17 E7.10 | 52.07,85.09 52.07,83.82 55.88,80.01 55.88,73.66 E9.10 60.96,69.85 62.23,68.58 62.23,66.04 60.96,64.77 E9.12 | E5.12 39.37,111.76 40.64,110.49 v40.64,105.41 | E3.10 11.43,49.53 v11.43,50.8
N$42  (via drill 0.81)
  Top 0.406: v59.69,102.87 64.77,97.79 v64.77,80.01
  Bottom 0.406: E6.13 58.42,109.22 57.15,107.95 57.15,105.41 v59.69,102.87 | E7.3 64.77,83.82 v64.77,80.01 62.23,80.01 57.15,74.93 57.15,73.66 58.42,72.39 E9.9
N$43
  Bottom 0.406: E9.8 63.5,74.93 67.31,78.74 E7.1
N$44  (via drill 0.81)
  Top 0.406: v57.15,50.8 TP1.1
  Bottom 0.406: E9.5 64.77,67.31 64.77,62.23 60.96,58.42 58.42,58.42 57.15,59.69 TP1.1 E9.13 | E10.9 v57.15,50.8
N$45
  Bottom 0.406: E9.7 63.5,71.12 63.5,63.5 E9.14
N$46  (via drill 0.81)
  Top 0.406: v35.56,80.01 38.1,80.01 40.64,77.47 v40.64,53.34
  Bottom 0.406: E13.13 36.83,83.82 35.56,82.55 v35.56,80.01 39.37,80.01 43.18,76.2 43.18,72.39 E11.5 | v40.64,53.34 48.26,53.34 57.15,44.45 57.15,43.18 E10.12
N$47
  Bottom 0.406: E13.14 40.64,81.28 45.72,76.2 E11.7
N$48  (via drill 0.81)
  Top 0.406: v64.77,58.42 v64.77,36.83
  Bottom 0.406: E9.3 66.04,63.5 66.04,59.69 v64.77,58.42 63.5,57.15 58.42,57.15 54.61,60.96 49.53,60.96 46.99,58.42 44.45,58.42 40.64,62.23 E11.13 | E10.1 66.04,35.56 v64.77,36.83
N$49
  Bottom 0.406: E11.14 41.91,59.69 44.45,57.15 48.26,57.15 50.8,59.69 53.34,59.69 57.15,55.88 64.77,55.88 67.31,58.42 E9.1
N$50  (via drill 0.81)
  Top 0.406: 8/5H.1 33.02,67.31 34.29,66.04 34.29,60.96 31.75,58.42 31.75,41.91 33.02,40.64 v33.02,33.02 | v63.5,30.48 64.77,30.48 68.58,34.29 68.58,46.99 v71.12,49.53
  Bottom 0.406: E11.9 34.29,72.39 8/5H.1 | v33.02,33.02 43.18,33.02 44.45,31.75 48.26,31.75 49.53,33.02 58.42,33.02 59.69,31.75 62.23,31.75 v63.5,30.48 | E10.7 69.85,50.8 v71.12,49.53
N$51
  Bottom 0.406: E11.8 30.48,74.93 8/5L.1
N$52  (via drill 0.81)
  Top 0.406: v31.75,88.9 27.94,85.09 27.94,71.12 33.02,66.04 33.02,60.96 30.48,58.42 30.48,41.91 31.75,40.64 31.75,30.48 TP2.1
  Bottom 0.406: E13.3 43.18,88.9 43.18,92.71 41.91,93.98 41.91,96.52 39.37,99.06 36.83,99.06 35.56,97.79 35.56,95.25 36.83,93.98 | 36.83,93.98 E13.9 | v31.75,88.9 36.83,93.98 | E4.6 64.77,25.4 58.42,31.75 49.53,31.75 48.26,30.48 34.29,30.48 TP2.1
N$53
  Bottom 0.406: E13.8 41.91,92.71 41.91,88.9 43.18,87.63 43.18,83.82 E13.1
N$54
  Bottom 0.406: U$2.BS2 115.88,13.66 115.57,13.97 107.95,13.97 R1.1
N$55  (via drill 0.81)
  Top 0.406: v92.71,26.67 90.17,24.13 90.17,13.97 93.98,10.16 93.98,6.35 90.17,2.54 76.2,2.54 68.58,10.16 67.31,10.16 64.77,12.7 64.77,27.94 67.31,30.48 v68.58,30.48 | v54.61,111.76 54.61,95.25 52.07,92.71 52.07,91.44 53.34,90.17 53.34,82.55 49.53,78.74 49.53,71.12 50.8,69.85 50.8,55.88 v52.07,54.61
  Bottom 0.406: E6.12 E6.6 | E6.12 E6.2 | 64.77,39.37 60.96,39.37 E10.13 58.42,38.1 57.15,36.83 57.15,35.56 59.69,33.02 66.04,33.02 v68.58,30.48 67.31,29.21 E4.7 | 64.77,39.37 66.04,39.37 E10.2 | 64.77,39.37 64.77,48.26 | 64.77,48.26 62.23,48.26 E10.10 58.42,45.72 52.07,52.07 v52.07,54.61 | 64.77,48.26 E10.6 | v92.71,26.67 E16.3 | v54.61,111.76 E6.12
N$56  (via drill 0.81)
  Top 0.406: v71.12,121.92 69.85,123.19 64.77,123.19 63.5,121.92 v63.5,104.14
  Bottom 0.406: v71.12,121.92 E6.7 | E7.9 60.96,93.98 62.23,95.25 62.23,102.87 v63.5,104.14
N$57
  Bottom 0.406: R2.1 R1.2 95.25,12.7 92.71,15.24 92.71,17.78 93.98,19.05 E16.6
N$58
  Bottom 0.406: U$2.BT2 117.17,10.49 116.84,10.16 109.22,10.16 R11.1
N$59
  Bottom 0.406: R11.2 R12.1 102.87,8.89 102.87,13.97 100.33,16.51 100.33,26.67 E16.13
N$60
  Bottom 0.406: E4.2 E4.12 54.61,12.7 E15.1 41.91,16.51 41.91,21.59 E15.9
N$61  (via drill 0.81)
  Top 0.406: v17.78,107.95 17.78,119.38 21.59,123.19 24.13,123.19 31.75,115.57 31.75,111.76 33.02,110.49 33.02,104.14 26.67,97.79 26.67,90.17 27.94,88.9 26.67,87.63 26.67,69.85 30.48,66.04 v30.48,63.5
  Bottom 0.406: E14.8 17.78,99.06 v17.78,107.95 17.78,114.3 E2.10 | E3.6 30.48,55.88 v30.48,63.5
N$62  (via drill 0.81)
  Top 0.406: v53.34,40.64 53.34,35.56 50.8,33.02 v50.8,29.21
  Bottom 0.406: E4.9 58.42,25.4 54.61,29.21 v50.8,29.21 | v53.34,40.64 50.8,40.64 E18.1 40.64,39.37 40.64,48.26 E18.8
N$63  (via drill 0.81)
  Top 0.406: v50.8,17.78 50.8,25.4 48.26,27.94 TP6.1
  Bottom 0.406: TP6.1 E18.7 | E15.8 43.18,22.86 43.18,20.32 E15.3 v50.8,17.78
N$64
  Bottom 0.406: E12.1 77.47,6.35 74.93,6.35 74.93,8.89 78.74,12.7 78.74,13.97 77.47,15.24 E12.13 74.93,15.24 73.66,13.97 71.12,13.97 E4.3
N$65  (via drill 0.81)
  Top 0.406: v102.87,114.3 101.6,115.57 95.25,115.57 93.98,116.84 93.98,120.65 87.63,127 58.42,127 57.15,125.73 53.34,125.73 | 53.34,125.73 13.97,125.73 v12.7,127 | v50.8,96.52 50.8,113.03 54.61,116.84 54.61,120.65 53.34,121.92 53.34,125.73
  Bottom 0.406: 8/5L.3 36.83,101.6 40.64,101.6 E13.7 v50.8,96.52 | R9.1 97.79,111.76 R10.1 v102.87,114.3 | E2.8 15.24,124.46 v12.7,127
N$66
  Bottom 0.406: 8/5H.2 33.02,78.74 34.29,77.47 40.64,77.47 41.91,76.2 41.91,71.12 43.18,69.85 43.18,67.31 E11.3
N$67
  Bottom 0.406: 8/5L.2 29.21,80.01 33.02,76.2 39.37,76.2 40.64,74.93 40.64,71.12 41.91,69.85 41.91,63.5 E11.1
N$68  (via drill 0.81)
  Top 0.406: v99.06,119.38 97.79,119.38 88.9,128.27 58.42,128.27 57.15,127 v17.78,127
  Bottom 0.406: R5.2 v99.06,119.38 R6.1 | v17.78,127 19.05,125.73 19.05,115.57 20.32,114.3 20.32,104.14 19.05,102.87 19.05,97.79 E14.9
N$69
  Bottom 0.406: U$2.AF2 117.12,112.04 116.84,111.76 R9.2
N$70  (via drill 0.81)
  Top 0.406: v68.58,7.62 60.96,7.62 57.15,11.43 57.15,17.78 54.61,20.32 54.61,21.59 55.88,22.86 55.88,29.21 58.42,31.75 58.42,46.99 54.61,50.8 54.61,58.42 52.07,60.96 52.07,69.85 50.8,71.12 50.8,78.74 54.61,82.55 v54.61,92.71 | v27.94,121.92 33.02,116.84 33.02,111.76 34.29,110.49 34.29,95.25 8/5H.3
  Bottom 0.406: E12.14 71.12,12.7 68.58,10.16 v68.58,7.62 | v54.61,92.71 46.99,92.71 E13.5 43.18,93.98 43.18,97.79 40.64,100.33 36.83,100.33 33.02,96.52 8/5H.3 | v27.94,121.92 E2.7
N$71  (via drill 0.81)
  Top 0.406: v93.98,106.68 93.98,113.03 88.9,118.11 88.9,121.92 85.09,125.73 58.42,125.73 v55.88,123.19
  Bottom 0.406: R14.1 100.33,106.68 R13.1 v93.98,106.68 | E6.9 v55.88,123.19
N$72
  Bottom 0.406: U$2.AD2 117.14,118.42 116.84,118.11 107.95,118.11 R5.1
N$73  (via drill 0.81)
  Top 0.406: v19.05,78.74 19.05,41.91 17.78,40.64 19.05,39.37 19.05,36.83 TP5.1
  Bottom 0.406: E4.1 E4.13 55.88,11.43 41.91,11.43 E15.13 36.83,15.24 35.56,13.97 35.56,11.43 38.1,8.89 38.1,6.35 36.83,5.08 34.29,5.08 27.94,11.43 20.32,11.43 19.05,12.7 19.05,16.51 17.78,17.78 17.78,30.48 TP5.1 | E14.1 21.59,81.28 v19.05,78.74
N$74
  Bottom 0.406: E5.10 36.83,116.84 35.56,118.11 25.4,118.11 24.13,116.84 E2.5
N$75  (via drill 0.81)
  Top 0.406: v92.71,21.59 92.71,13.97 99.06,7.62 92.71,1.27 66.04,1.27 59.69,7.62 54.61,7.62 50.8,3.81 29.21,3.81 27.94,5.08 27.94,16.51 25.4,19.05 25.4,20.32 27.94,22.86 27.94,30.48 24.13,34.29 24.13,38.1 v25.4,39.37 | v48.26,15.24 v48.26,25.4 46.99,26.67 46.99,29.21 43.18,33.02 v43.18,48.26
  Bottom 0.406: v92.71,21.59 E16.5 | v43.18,48.26 36.83,54.61 34.29,54.61 27.94,48.26 27.94,41.91 v25.4,39.37 24.13,38.1 E3.2 | v43.18,48.26 E18.6 | E18.2 44.45,38.1 43.18,39.37 v43.18,48.26 | v48.26,15.24 E15.2 | v48.26,25.4 E15.6
N$76
  Bottom 0.406: 1.5|2.0-1.0.2 E4.10
N$77
  Bottom 0.406: R4.1 R3.2 10.16,5.08 7.62,7.62 7.62,19.05 11.43,22.86 E17.10
N$78
  Bottom 0.406: U$2.BV2 117.23,4.2 116.84,3.81 105.41,3.81 102.87,1.27 27.94,1.27 R3.1
N$79  (via drill 0.81)
  Top 0.406: v63.5,8.89 v63.5,24.13 | v54.61,5.08 52.07,2.54 12.7,2.54 10.16,5.08 10.16,12.7 v11.43,13.97
  Bottom 0.406: v63.5,24.13 E4.8 | v63.5,8.89 62.23,7.62 57.15,7.62 v54.61,5.08 | E17.13 12.7,15.24 v11.43,13.97
N$80  (via drill 0.81)
  Top 0.406: v35.56,22.86 36.83,24.13 36.83,39.37 v35.56,40.64
  Bottom 0.406: E18.10 39.37,44.45 39.37,41.91 E18.12 v35.56,40.64 | E15.12 39.37,19.05 39.37,21.59 E15.10 v35.56,22.86 E17.5 19.05,26.67 19.05,36.83 E3.12 10.16,40.64 8.89,41.91 8.89,101.6 10.16,102.87 11.43,102.87 12.7,101.6 12.7,93.98 E14.10
N$81  (via drill 0.81)
  Top 0.406: v35.56,52.07 48.26,52.07 50.8,49.53 1.5.1
  Bottom 0.406: E18.3 44.45,41.91 44.45,44.45 E18.5 1.5.1 | 1.0|2.0.2 29.21,38.1 29.21,45.72 v35.56,52.07
N$82
  Bottom 0.406: E18.14 41.91,35.56 44.45,33.02 46.99,33.02 1.5.2 1.5|2.0-1.0.1
N$83  (via drill 0.81)
  Top 0.406: v31.75,16.51 38.1,10.16 40.64,10.16 41.91,11.43 v41.91,27.94
  Bottom 0.406: E15.5 41.91,26.67 v41.91,27.94 | E17.2 30.48,15.24 v31.75,16.51
N$84  (via drill 0.81)
  Top 0.406: v30.48,6.35 30.48,40.64 26.67,44.45 26.67,59.69 v27.94,60.96
  Bottom 0.406: E4.14 58.42,12.7 55.88,10.16 49.53,10.16 48.26,8.89 43.18,8.89 38.1,3.81 33.02,3.81 v30.48,6.35 | v27.94,60.96 26.67,59.69 26.67,55.88 24.13,53.34 12.7,53.34 10.16,55.88 10.16,82.55 11.43,83.82 E14.13
N$85
  Bottom 0.406: 16.51,62.23 E1.13 | 16.51,62.23 17.78,63.5 17.78,74.93 15.24,77.47 15.24,78.74 17.78,81.28 17.78,95.25 20.32,97.79 20.32,101.6 25.4,106.68 C20.2 | 16.51,62.23 13.97,62.23 12.7,60.96 12.7,58.42 15.24,55.88 R8.1
N$86
  Bottom 0.406: E1.6 21.59,72.39 20.32,73.66 20.32,74.93 | 20.32,74.93 19.05,74.93 16.51,77.47 16.51,78.74 19.05,81.28 19.05,95.25 21.59,97.79 21.59,101.6 25.4,105.41 C19.2 | 20.32,74.93 R7.1
N$87
  Bottom 0.406: E14.5 25.4,93.98 25.4,95.25 27.94,97.79 C20.1
N$88
  Bottom 0.406: E14.3 25.4,86.36 27.94,88.9 27.94,91.44 26.67,92.71 26.67,95.25 C19.1
N$89
  Bottom 0.406: E17.7 25.4,25.4 1.0|2.0.1
N$90  (via drill 0.81)
  Top 0.406: v12.7,27.94 13.97,29.21 17.78,29.21 21.59,33.02 v25.4,29.21
  Bottom 0.406: v25.4,29.21 25.4,30.48 27.94,33.02 27.94,34.29 30.48,36.83 30.48,44.45 34.29,48.26 E18.9 | v12.7,27.94 E17.8
N$91  (via drill 0.81)
  Top 0.406: v24.13,100.33 16.51,100.33 TP3.1
  Bottom 0.406: E14.7 22.86,99.06 v24.13,100.33 | TP3.1 12.7,104.14 10.16,104.14 7.62,101.6 7.62,41.91 13.97,35.56 E3.14
N$92
  Bottom 0.406: E5.1 48.26,106.68 53.34,101.6 | 53.34,101.6 55.88,104.14 55.88,105.41 52.07,109.22 52.07,115.57 E5.7 | 53.34,101.6 58.42,96.52 E7.8
N$93
  Bottom 0.406: E17.6 24.13,24.13 31.75,24.13 36.83,29.21 44.45,29.21 E15.7
N$94  (via drill 0.81)
  Top 0.406: v11.43,86.36 11.43,97.79 12.7,99.06 12.7,102.87 13.97,104.14 22.86,104.14 24.13,105.41 24.13,111.76 TP4.1
  Bottom 0.406: E5.14 36.83,106.68 TP4.1 | v11.43,86.36 E14.12
N$95  (via drill 0.81)
  Top 0.406: v11.43,81.28 12.7,80.01 22.86,80.01 24.13,78.74 24.13,76.2 21.59,76.2 20.32,74.93 v20.32,40.64 20.32,34.29 16.51,30.48 12.7,30.48 v11.43,31.75
  Bottom 0.406: v11.43,81.28 E14.14 | E3.3 v20.32,40.64 20.32,38.1 E3.1 | E17.9 11.43,25.4 10.16,26.67 10.16,30.48 v11.43,31.75
RRUN
  Bottom 0.406: U$2.BL2 117.17,29.54 116.84,29.21 109.22,29.21 102.87,35.56 Q12.3
STROBEF
  Bottom 0.406: U$2.AN2 115.9,93.04 115.57,92.71 111.76,92.71 107.95,96.52 107.95,99.06 104.14,102.87 100.33,102.87 Q2.3
VCC  (via drill 0.81)
  Top 0.813: 35.56,124.46 13.97,124.46 11.43,121.92 v11.43,114.3 v11.43,100.33 8.89,97.79 8.89,69.85 v11.43,67.31 8.89,64.77 8.89,45.72 v11.43,43.18 8.89,40.64 8.89,21.59 v11.43,19.05 | 35.56,124.46 v35.56,114.3 v35.56,88.9 31.24,84.84 31.24,80.52 35.56,76.2 v35.56,67.31 35.56,59.69 v33.02,57.15 33.02,50.8 34.29,49.53 v34.29,43.18 34.29,39.37 35.56,38.1 35.56,25.4 33.02,22.86 v35.56,20.32 | 35.56,124.46 46.99,124.46 v52.07,119.38 | v92.71,111.76 85.09,104.14 74.93,104.14 | 74.93,104.14 72.39,106.68 v72.39,111.76 73.66,113.03 73.66,121.92 71.12,124.46 59.69,124.46 57.15,121.92 v57.15,114.3 | 74.93,104.14 74.93,30.48 73.66,29.21 v73.66,22.86 73.66,12.7 76.2,10.16 86.36,10.16 88.9,7.62 v91.44,7.62 | v57.15,20.32 57.15,27.94 62.23,33.02 v62.23,43.18 62.23,74.93 59.69,77.47 57.15,74.93 | 57.15,74.93 v57.15,67.31 | 57.15,74.93 53.34,74.93 53.34,78.74 57.15,82.55 v57.15,88.9 v57.15,114.3 | v57.15,114.3 54.61,114.3 52.07,111.76 52.07,106.68 v53.34,105.41
  Bottom 0.813: v91.44,7.62 R2.2 | v91.44,7.62 R12.2 | E16.11 104.14,24.13 105.41,22.86 105.41,15.24 104.14,13.97 104.14,6.35 100.33,2.54 96.52,2.54 v91.44,7.62 | U$2.AJ2 117.17,105.74 116.84,105.41 110.49,105.41 109.22,104.14 93.98,104.14 91.44,106.68 91.44,107.95 R14.2 v92.71,111.76 R10.2 91.44,115.57 R6.2 | v11.43,114.3 E2.11 | E14.11 11.43,92.71 v11.43,100.33 | v35.56,114.3 E5.11 | E6.11 v57.15,114.3 v52.07,119.38 | E8.11 74.93,114.3 v72.39,111.76 | v73.66,22.86 E12.11 | R4.2 10.16,7.62 8.89,8.89 8.89,16.51 v11.43,19.05 13.97,19.05 E17.11 | v62.23,43.18 E10.11 | v57.15,20.32 E4.11 | v57.15,67.31 E9.11 | v57.15,88.9 E7.11 | v35.56,88.9 E13.11 | v35.56,67.31 E11.11 | v35.56,20.32 E15.11 | v34.29,43.18 E18.11 | v11.43,43.18 E3.11 | 12.7,67.31 E1.11 | R8.2 11.43,57.15 v11.43,67.31 12.7,67.31 | 12.7,67.31 R7.2 | E5.5 43.18,114.3 E5.3 46.99,111.76 v53.34,105.41 | E3.5 33.02,55.88 v33.02,57.15

### Text on the board
Bottom: TELETYPE RECEIVER W706C | 7-67